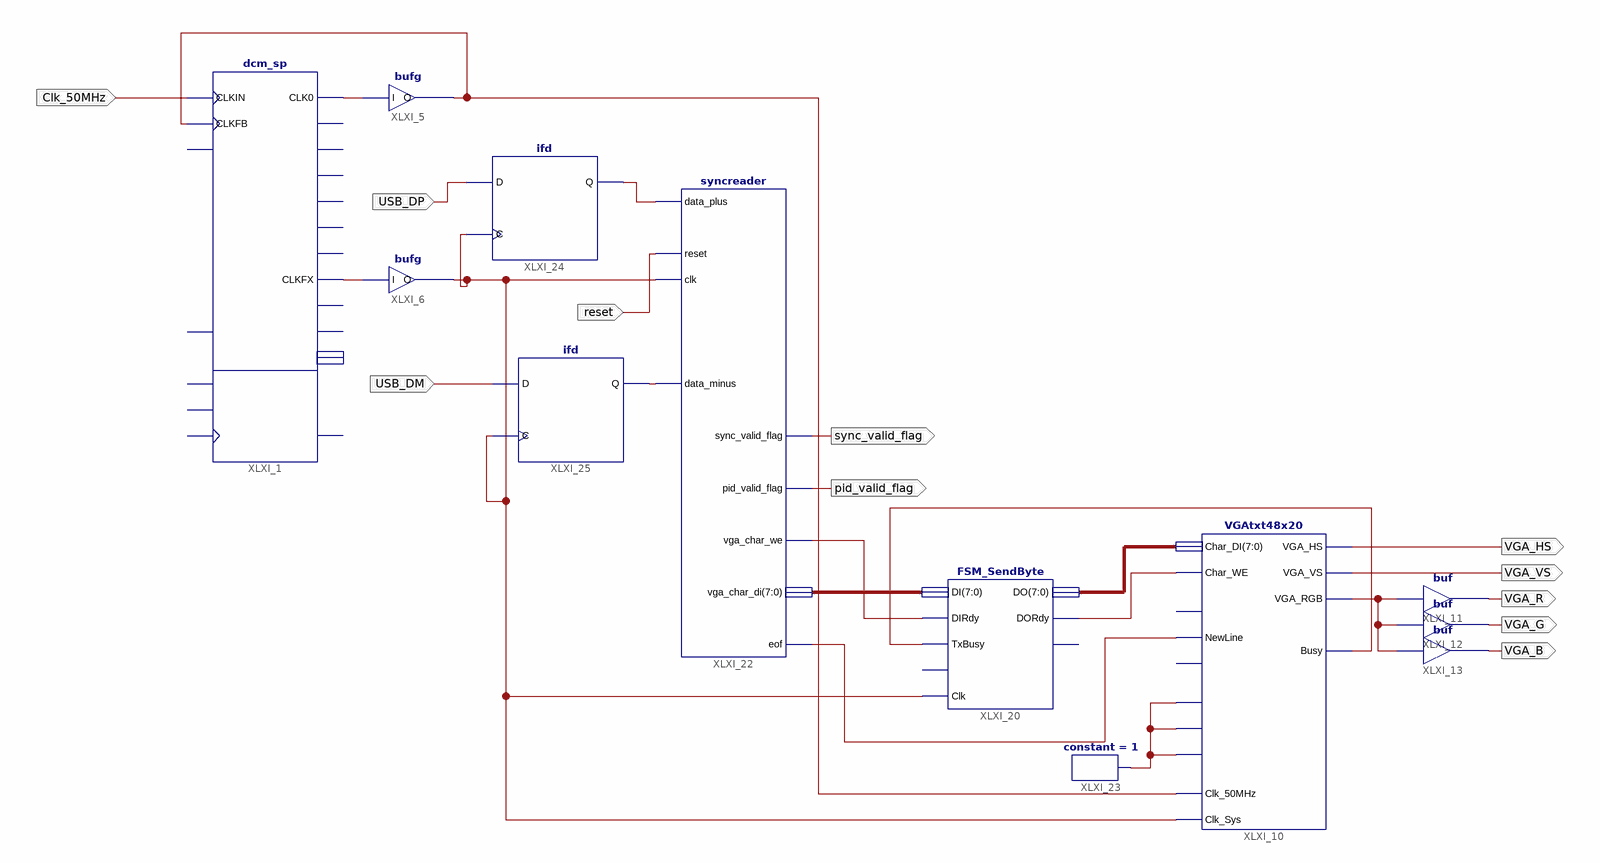
[diagram p0: schematic sheet 1]
// Xilinx ISE schematic schema.sch (spartan3e) as structural Verilog: 12 symbols, 11 ports
module schema (
  input  reset,
  input  Clk_50MHz,
  input  USB_DP,
  input  USB_DM,
  output sync_valid_flag,
  output pid_valid_flag,
  output VGA_VS,
  output VGA_R,
  output VGA_G,
  output VGA_B,
  output VGA_HS
);

  wire Clk50, ClkSys, XLXN_7, XLXN_8, XLXN_12, XLXN_79, XLXN_80, XLXN_81, XLXN_108, XLXN_110, XLXN_114,
       XLXN_119;
  wire [7:0] XLXN_77, XLXN_78;

  dcm_sp #(.CLKFX_MULTIPLY(6), .CLKFX_DIVIDE(5)) XLXI_1 (
    .CLKFB(Clk50), .CLKIN(Clk_50MHz), .CLK0(XLXN_7), .CLKFX(XLXN_8));  // open: DSSEN, PSCLK, PSEN, PSINCDEC, RST, CLK180, CLK270, CLK2X, CLK2X180, CLK90, CLKDV, CLKFX180, LOCKED, PSDONE, STATUS
  bufg XLXI_5 (.I(XLXN_7), .O(Clk50));
  bufg XLXI_6 (.I(XLXN_8), .O(ClkSys));
  ifd XLXI_24 (.C(ClkSys), .D(USB_DP), .Q(XLXN_108));
  ifd XLXI_25 (.C(ClkSys), .D(USB_DM), .Q(XLXN_110));
  buf XLXI_11 (VGA_R, XLXN_12);
  buf XLXI_12 (VGA_G, XLXN_12);
  buf XLXI_13 (VGA_B, XLXN_12);
  VGAtxt48x20 XLXI_10 (
    .Char_DI(XLXN_78), .NewLine(XLXN_114), .Clk_Sys(ClkSys), .Clk_50MHz(Clk50), .CursorOn(XLXN_119),
    .ScrollEn(XLXN_119), .ScrollClear(XLXN_119), .Busy(XLXN_81), .VGA_HS(VGA_HS), .VGA_VS(VGA_VS),
    .VGA_RGB(XLXN_12), .Char_WE(XLXN_80));  // open: Home, Goto00
  FSM_SendByte XLXI_20 (
    .DORdy(XLXN_80), .DO(XLXN_78), .DI(XLXN_77), .DIRdy(XLXN_79), .TxBusy(XLXN_81), .Clk(ClkSys));  // open: Busy, Reset
  syncreader XLXI_22 (
    .data_plus(XLXN_108), .data_minus(XLXN_110), .reset(reset), .clk(ClkSys),
    .sync_valid_flag(sync_valid_flag), .pid_valid_flag(pid_valid_flag), .vga_char_we(XLXN_79),
    .eof(XLXN_114), .vga_char_di(XLXN_77));
  constant #(.CValue("1")) XLXI_23 (.O(XLXN_119));
endmodule
